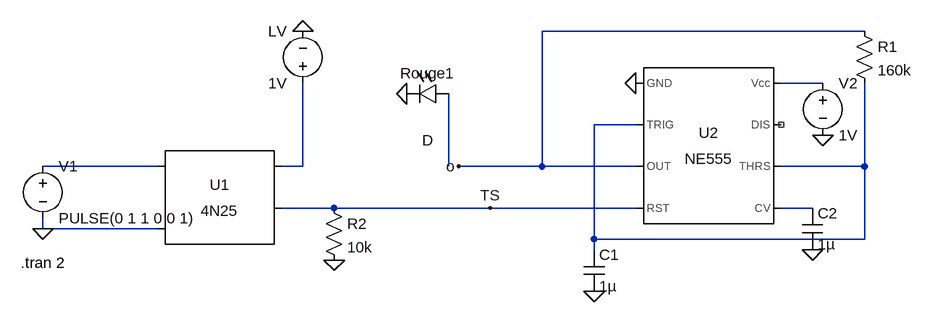
[diagram p0: schematic Test_opto.asc]
Test_opto.asc, the LTspice schematic file:
Version 4
SHEET 1 1296 680
WIRE 1216 -96 720 -96
WIRE 1152 -16 1088 -16
WIRE 864 48 800 48
WIRE 128 112 -48 112
WIRE 352 112 352 -16
WIRE 352 112 320 112
WIRE 576 112 576 0
WIRE 720 112 720 -96
WIRE 720 112 592 112
WIRE 864 112 720 112
WIRE 1216 112 1216 -16
WIRE 1216 112 1088 112
WIRE 400 176 320 176
WIRE 640 176 400 176
WIRE 864 176 640 176
WIRE 1136 176 1088 176
WIRE -48 208 -48 192
WIRE 128 208 -48 208
WIRE 800 224 800 48
WIRE 1216 224 1216 112
WIRE 1216 224 800 224
WIRE 800 240 800 224
FLAG -48 208 0
FLAG 352 -96 0
FLAG 640 176 TS
FLAG 864 -16 0
FLAG 1136 240 0
FLAG 800 304 0
FLAG 1152 64 0
FLAG 592 112 o
FLAG 512 0 0
FLAG 400 256 0
SYMBOL Optos\\4N25 224 176 R0
SYMATTR InstName U1
SYMBOL voltage -48 96 R0
WINDOW 123 0 0 Left 0
WINDOW 39 0 0 Left 0
SYMATTR InstName V1
SYMATTR Value PULSE(0 1 1 0 0 1)
SYMBOL voltage 352 0 R180
WINDOW 0 24 96 Left 2
WINDOW 3 24 16 Left 2
SYMATTR InstName LV
SYMATTR Value 1V
SYMBOL Misc\\NE555 976 80 R0
SYMATTR InstName U2
SYMBOL cap 784 240 R0
SYMATTR InstName C1
SYMATTR Value 1µ
SYMBOL cap 1120 176 R0
SYMATTR InstName C2
SYMATTR Value 1µ
SYMBOL res 1200 -112 R0
SYMATTR InstName R1
SYMATTR Value 160k
SYMBOL voltage 1152 -32 R0
SYMATTR InstName V2
SYMATTR Value 1V
SYMBOL LED 576 -16 R90
WINDOW 0 0 32 VBottom 2
WINDOW 3 72 32 VTop 2
SYMATTR InstName Rouge1
SYMBOL res 384 160 R0
SYMATTR InstName R2
SYMATTR Value 10k
TEXT -82 260 Left 2 !.tran 2

The netlist it stands for:
* Test_opto.asc
XU1 N003 0 N004 TS NC_01 4N25
V1 N003 0 PULSE(0 1 1 0 0 1)
V§LV N004 0 1V
XU2 0 N002 o TS N006 N002 NC_02 N001 NE555  ; pins GND TRIG OUT RST CV THRS DIS Vcc
C1 N002 0 1µ
C2 N006 0 1µ
R1 o N002 160k
V2 N001 0 1V
D§Rouge1 N005 0 D
R2 TS 0 10k
.model D D
.lib standard.dio
.tran 2
.lib 4N25.sub
.lib NE555.sub
.backanno
.end